# Altium schematic sheet FPGA_JTAG.SchDoc
size A4
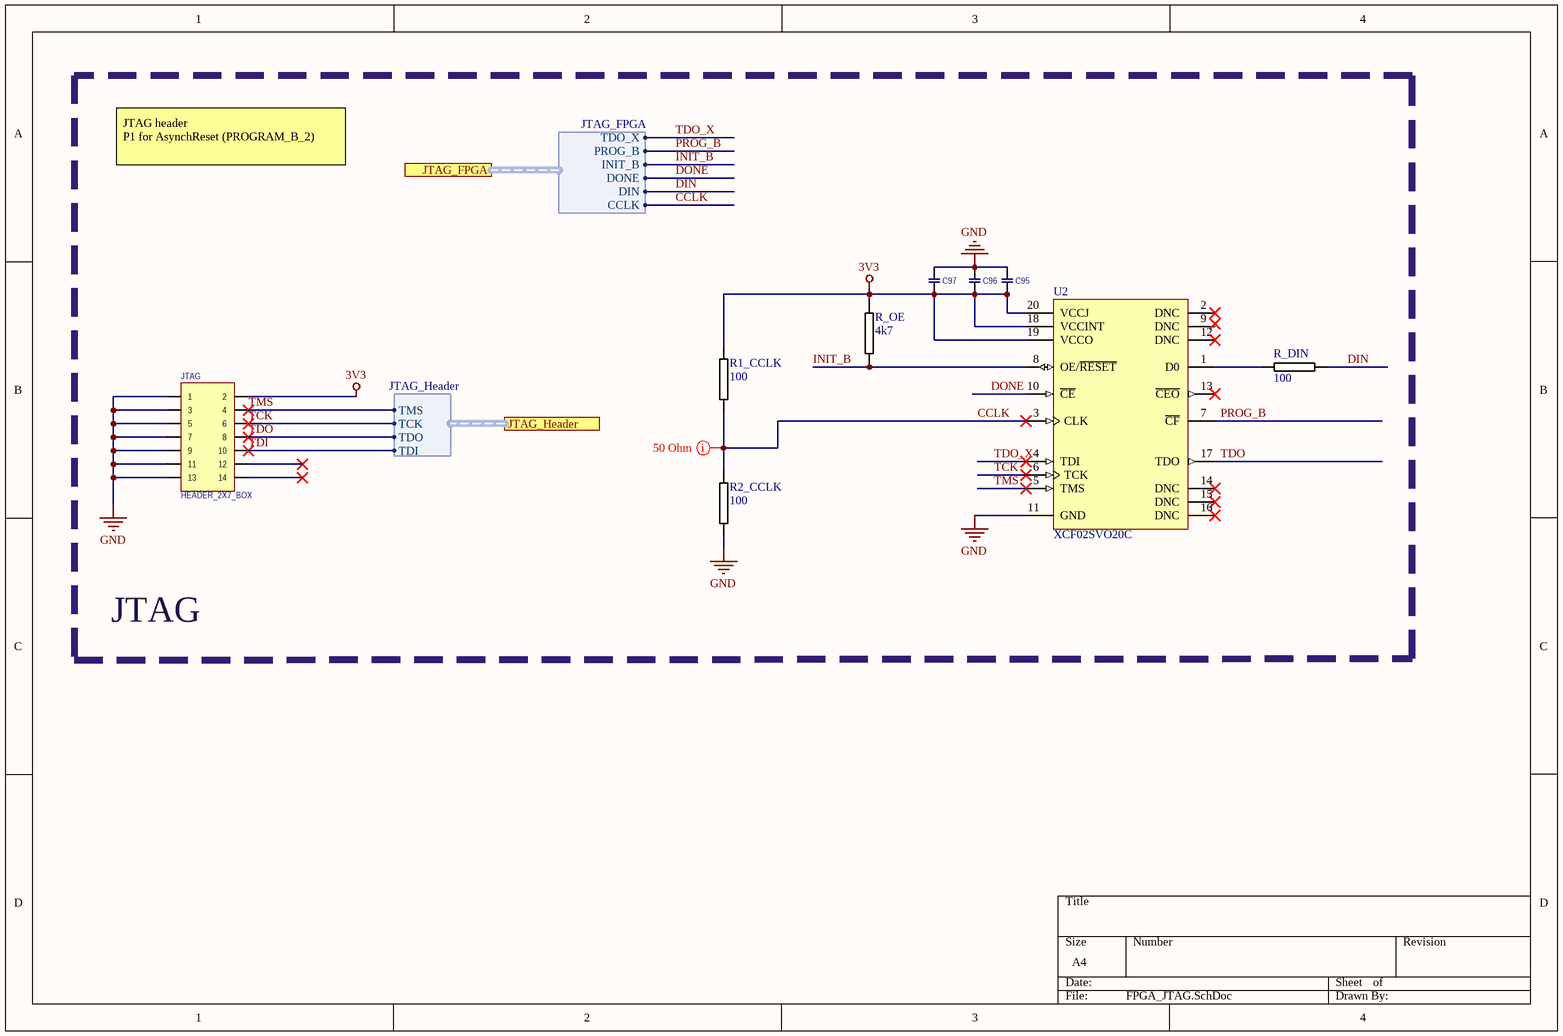
[diagram p0: FPGA_JTAG.SchDoc]

## Parts
C95  100NF_0603_50V_X7R  [CAP0603]  (value not drawn)
C96  470NF_0603_50V_X7R  [CAP0603]  (value not drawn)
C97  1UF_0603_50V_X7R  [CAP0603]  (value not drawn)
JTAG  HEADER_2X7_BOX  [X14ABPB]
R1_CCLK  100  [0603R-TBD]
R2_CCLK  100  [0603R-TBD]
R_DIN  100  [0603R-TBD]
R_OE  4k7  [0603R-TBD]
U2  XCF02SVO20C  [VO20_N]

## Blocks framed on the sheet
JTAG: C95-C97 JTAG R1_CCLK R2_CCLK R_DIN R_OE U2

## Ports
JTAG_FPGA (harness JTAG_FPGA), JTAG_Header (harness JTAG_Header)

## Harnesses
JTAG_FPGA: CCLK, DIN, DONE, INIT_B, PROG_B, TDO_X
JTAG_Header: TCK, TDI, TDO, TMS

## Nets
3V3: C95.2 C96.2 C97.2 JTAG.2 R1_CCLK.1 R_OE.1 U2.18(VCCINT) U2.19(VCCO) U2.20(VCCJ)
GND: C95.1 C96.1 C97.1 JTAG.1 JTAG.3 JTAG.5 JTAG.7 JTAG.9 JTAG.11 JTAG.13 R2_CCLK.2 U2.11(GND)
CCLK: R1_CCLK.2 R2_CCLK.1 U2.3(CLK) ; port JTAG_FPGA.CCLK
DIN: R_DIN.2 ; port JTAG_FPGA.DIN
DONE: U2.10(~{CE}) ; port JTAG_FPGA.DONE
INIT_B: R_OE.2 U2.8(OE/~{RESET}) ; port JTAG_FPGA.INIT_B
PROG_B: U2.7(~{CF}) ; port JTAG_FPGA.PROG_B
TCK: JTAG.6 U2.6(TCK) ; port JTAG_Header.TCK
TDI: JTAG.10 ; port JTAG_Header.TDI
TDO: JTAG.8 U2.17(TDO) ; port JTAG_Header.TDO
TDO_X: U2.4(TDI) ; port JTAG_FPGA.TDO_X
TMS: JTAG.4 U2.5(TMS) ; port JTAG_Header.TMS
NetR_DIN_1: R_DIN.1 U2.1(D0)

Not connected (* = marked no-connect by the designer): JTAG 12* 14*; U2 2(DNC)* 9(DNC) 12(DNC)* 13(~{CEO})* 14(DNC)* 15(DNC)* 16(DNC)*

## Layout directives
mark named 50 Ohm: CCLK

## Notes on the sheet
- JTAG header
  P1 for AsynchReset (PROGRAM_B_2)

## Library data of the parts
C95-C97 = 100NF_0603_50V_X7R: 128-8255    Capacitor MLC-X7R_0603_100NF_10%_50V; C0603C104K5RAC; KEMET; RoHS=Yes
JTAG = HEADER_2X7_BOX: 636-344    STRAIGHT HEADER, DOUBLE ROW OF 7 PINS EACH, BOX, GOLD PLATED, 2.54MM PITCH, 1MM HOLE (match 636-046 SOCKET); 008380014000010; ELCO; RoHS=Yes (alt. 381-6266, 109-9256)
R1_CCLK R2_CCLK R_DIN R_OE = 0603R-TBD: RESISTOR 0603 VALUE TO BE DETERMINED
U2 = XCF02SVO20C: XCF00S Series, Platform Flash In-System Programmable Configuration 3.3V PROM, 20-Pin TSOP, 2-Megabit, Commercial Grade; Published: 17-Sep-2003; LatestRevisionDate: 16-Nov-2009; LatestRevisionNote: Updated to datasheet version 2.17, Oct-2009.; DatasheetVersion: ver2.17, Oct-2009; PackageVersion: ver1.3, Dec-2008; PackageReference: VO20; Publisher: Altium Limited; PackageDescription: 20-Pin Thin Shrink Small Outline Package (VO20); Supplier 1: Digi-Key; Supplier Part Number 1: XCF02SVO20C-ND; Code_JEDEC: MO-153-AC; ComponentLink1Description: Platform Flash Datasheet; ComponentLink1URL: http://www.xilinx.com/support/documentation/data_sheets/ds123.pdf; ComponentLink2Description: VO20 Package Drawing; ComponentLink2URL: http://www.xilinx.com/support/documentation/package_specs/vo20.pdf; ComponentLink3Description: Configuration PROM Documents; ComponentLink3URL: http://www.xilinx.com/support/documentation/configuration_proms.htm; ComponentLink4Description: Xilinx.com Home; ComponentLink4URL: http://www.xilinx.com